# Altium project ActiTouch.PrjPcb
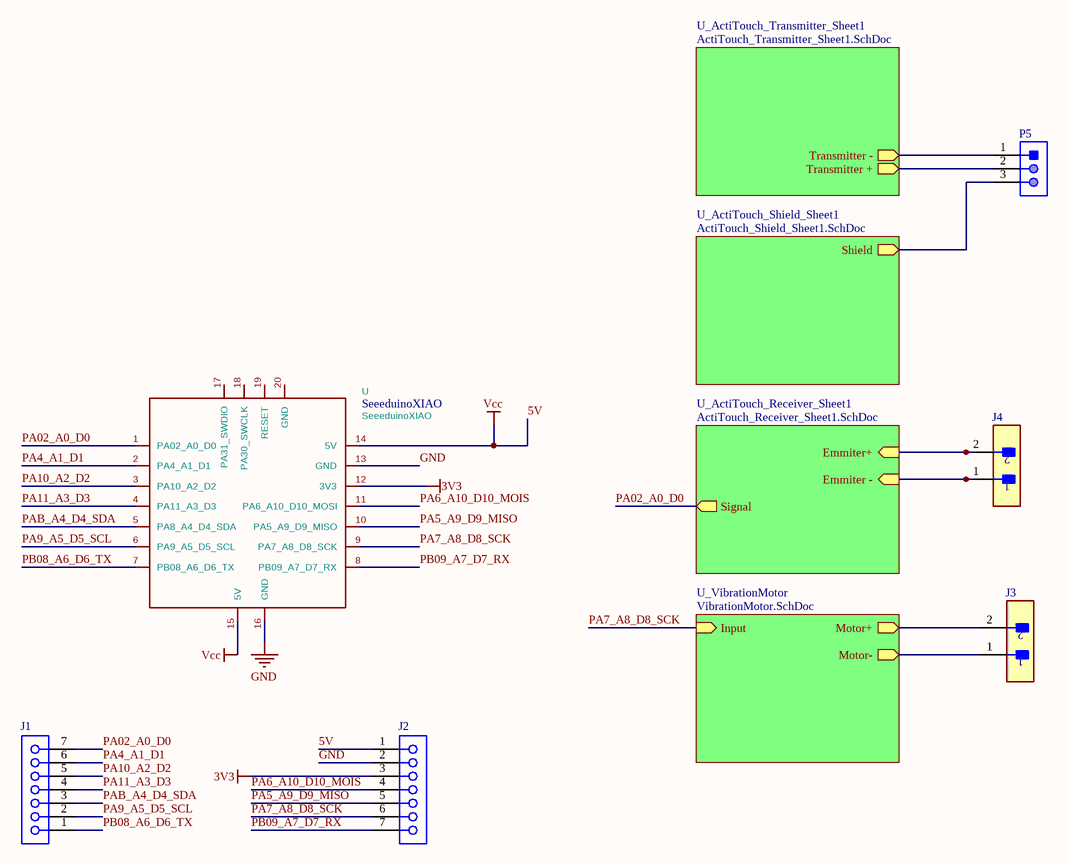
[diagram p0: ActiTouch.SchDoc]
5 sheets, 50 parts. Net scope: hierarchical (ports join the sheet entries above them; power ports are global).
Board file: PCB_Final.PcbDoc
Sheets:
  ActiTouch.SchDoc
    U_ActiTouch_Shield_Sheet1 = ActiTouch_Shield_Sheet1.SchDoc
    U_VibrationMotor = VibrationMotor.SchDoc
    U_ActiTouch_Receiver_Sheet1 = ActiTouch_Receiver_Sheet1.SchDoc
    U_ActiTouch_Transmitter_Sheet1 = ActiTouch_Transmitter_Sheet1.SchDoc

## Sheet ActiTouch.SchDoc
size A4; SheetNumber: 1; SheetTotal: 5

### Parts
J1  SSQ-107-01-G-S  [SMTC-SSQ-107-01-X-S]  (value not drawn)
J2  SSQ-107-01-G-S  [SMTC-SSQ-107-01-X-S]  (value not drawn)
J3  GRPB021VWVN-RC  [FP-GRPB021VWVN-RC-MFG]  (value not drawn)
J4  GRPB021VWVN-RC  [FP-GRPB021VWVN-RC-MFG]  (value not drawn)
P5  GRPB031VWVN-RC  [SLIN-GRPB031VWVN-RC_V]  (value not drawn)
U  SeeeduinoXIAO  [Seeeduino XIAO-MOUDLE14P-2.54-21X17.8MM]

### Sub-sheets
U_ActiTouch_Receiver_Sheet1 = ActiTouch_Receiver_Sheet1.SchDoc: Emmiter+ (in), Emmiter - (in), Signal (out)
U_ActiTouch_Shield_Sheet1 = ActiTouch_Shield_Sheet1.SchDoc: Shield (out)
U_ActiTouch_Transmitter_Sheet1 = ActiTouch_Transmitter_Sheet1.SchDoc: Transmitter + (out), Transmitter - (out)
U_VibrationMotor = VibrationMotor.SchDoc: Input (in), Motor+ (out), Motor- (out)

### Nets
3V3: J2.3 U.12(3V3)
5V: J2.1 U.14(5V) U.15(5V)  [also labelled Vcc]
GND: J2.2 U.13(GND) U.16(GND)
PA02_A0_D0: J1.7 U.1(PA02_A0_D0) ; sheet U_ActiTouch_Receiver_Sheet1/Signal
PA4_A1_D1: J1.6 U.2(PA4_A1_D1)
PA5_A9_D9_MISO: J2.5 U.10(PA5_A9_D9_MISO)
PA6_A10_D10_MOIS: J2.4 U.11(PA6_A10_D10_MOSI)
PA7_A8_D8_SCK: J2.6 U.9(PA7_A8_D8_SCK) ; sheet U_VibrationMotor/Input
PA9_A5_D5_SCL: J1.2 U.6(PA9_A5_D5_SCL)
PA10_A2_D2: J1.5 U.3(PA10_A2_D2)
PA11_A3_D3: J1.4 U.4(PA11_A3_D3)
PAB_A4_D4_SDA: J1.3 U.5(PA8_A4_D4_SDA)
PB08_A6_D6_TX: J1.1 U.7(PB08_A6_D6_TX)
PB09_A7_D7_RX: J2.7 U.8(PB09_A7_D7_RX)
NetC1_1: J3.2 ; sheet U_VibrationMotor/Motor+
NetC1_2: J3.1 ; sheet U_VibrationMotor/Motor-
NetC4_2: P5.3 ; sheet U_ActiTouch_Shield_Sheet1/Shield
NetC7_1: P5.1 ; sheet U_ActiTouch_Transmitter_Sheet1/Transmitter -
NetC8_1: P5.2 ; sheet U_ActiTouch_Transmitter_Sheet1/Transmitter +
NetC20_1: J4.2 ; sheet U_ActiTouch_Receiver_Sheet1/Emmiter+
NetC21_1: J4.1 ; sheet U_ActiTouch_Receiver_Sheet1/Emmiter -

Not connected (* = marked no-connect by the designer): U 17(PA31_SWDIO) 18(PA30_SWCLK) 19(RESET) 20(GND)

### Library data of the parts
J1 J2 = CMP-1023-00284-1: SQ Post Socket, Through-hole, Vertical, -55 to 125 degC, 2.54 mm Pitch, 7-Pin, Female, RoHS; Manufacturer: Samtec; Pitch: 2.54 mm; PackageDescription: Assembly, Socket Strip .025[0.64] SQ Tail; PartNumber: SSQ-107-01-G-S; PackageReference: SSQ-107-01-X-S; ComponentLink2URL: http://www.samtec.com/documents/webfiles/pdf/SSQ_TH.PDF; ComponentLink1URL: http://www.samtec.com; ComponentLink3Description: Package Specification; PackageVersion: BD, 6/1987; RoHS: True; DatasheetVersion: F-214; Mounting Technology: Through-hole; ComponentLink3URL: http://www.samtec.com/documents/webfiles/cpdf/SSQ-1XX-XX-XXX-X-XX-XXX-XX-X-MKT.pdf; ComponentLink1Description: Manufacturer URL; Temperature Range: -55 to 125 degC; Orientation: Vertical; ComponentLink2Description: Datasheet
J3 J4 = CMP-2000-06371-2: CONN HEADER VERT 2POS 1.27MM; Number of Positions: 2; Connector Type: Male Pin; Pitch: 0.05inch; Contact Plating: Gold; Lead Free: Lead Free; Termination: Solder; Packaging: Bulk; RoHS Compliant: Yes; Contact Type: Male Pin; Mount: Through Hole; Number of Rows: 1; Contact Mating Length: 0.118inch; Package Quantity: 1
P5 = CMP-2000-06372-1: Male Header, Pitch 1.27 mm, 1 x 3 Position, Height 4 mm, Tail Length 2.3 mm, -40 to 105 degC, RoHS, Bulk; Manufacturer: Sullins; Other Names: S9014E-03; Number of Positions: 3; Connector Type: Header,Unshrouded; Pitch: 0.050"(1.27mm); Dynamic Catalog: GRPB; Catalog Drawings: S9014ESeriesTop; Mating Products: S9010E-03-ND / -CONNHEADER.050"3POSR/APCB / S9008E-03-ND / -CONNHEADER.050"3POSPCBGOLD / S9005E-03-ND / -CONNHEADER.050"3POSSMDGOLD; Number of Positions Loaded: All; Contact Finish: Gold; Mounting Type: ThroughHole; Termination: Solder; Packaging: Bulk; Category: Connectors,Interconnects; Package Description: Male Header, Pitch 1.27 mm, 1 x 3 Position, Height 4 mm, Tail Length 2.3 mm; Standard Package: 1; Datasheet URL: http://www.sullinscorp.com/drawings/71_GRPB___1VWVN-RC,_10957-C.pdf; Package Reference: GRPB031VWVN-RC; Family: RectangularConnectors-Headers,MalePins; Number of Rows: 1; Contact Type: MalePin; Manufacturer URL: http://www.sullinscorp.com/; Mounting Technology: ThroughHole; Contact Mating Length: 0.118"(3.00mm); Contact Finish Thickness: Flash; Datasheet Version: Rev. C, 12/2008
U = SeeeduinoXIAO: Value: SeeeduinoXIAO

## Sheet ActiTouch_Shield_Sheet1.SchDoc
size A4; SheetNumber: 3; SheetTotal: 5
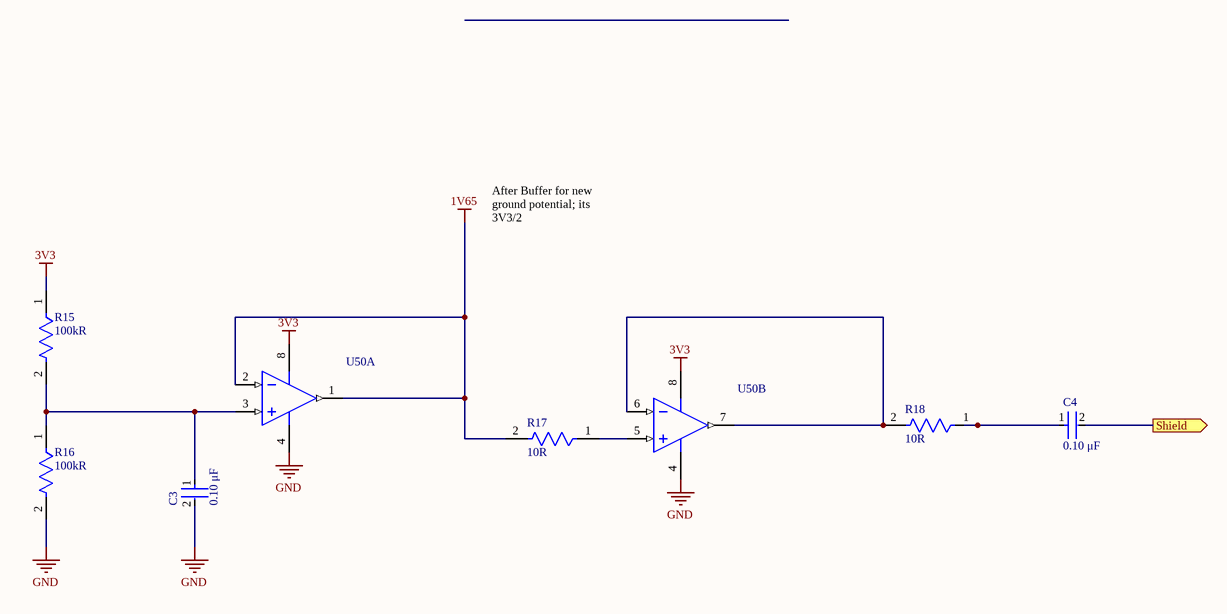
[diagram p1: ActiTouch_Shield_Sheet1.SchDoc]

### Parts
C3  value 0.10 μF  [FP-C0603C-CF-MFG]  (hidden comment: C0603C104K5RACTU)
C4  value 0.10 μF  [FP-C0603C-CF-MFG]  (hidden comment: C0603C104K5RACTU)
R15  Resistance: 100kR  [FP-ESR03-MFG]  (hidden comment: ESR03EZPJ101)
R16  Resistance: 100kR  [FP-ESR03-MFG]  (hidden comment: ESR03EZPJ101)
R17  Resistance: 10R  [FP-ESR03-MFG]  (hidden comment: ESR03EZPJ101)
R18  Resistance: 10R  [FP-ESR03-MFG]  (hidden comment: ESR03EZPJ101)
U50  LTC6253IMS8#TRPBF  [LT-MS8-8_M]  (value not drawn)  (parts A,B of 2)

### Ports
Shield (out)

### Nets
1V65: R17.2 U50.1(OUT_A) U50.2(-IN_A)
3V3: R15.1 U50.8(V+)
GND: C3.2 R16.2 U50.4(V-)
NetC3_1: C3.1 R15.2 R16.1 U50.3(+IN_A)
NetC4_1: C4.1 R18.1
NetC4_2: C4.2 ; port Shield
NetR17_1: R17.1 U50.5(+IN_B)
NetR18_2: R18.2 U50.6(-IN_B) U50.7(OUT_B)

### Notes on the sheet
- After Buffer for new ground potential; its 3V3/2

### Library data of the parts
C3 C4 = CMP-2006-03061-2: CAP CER 0.1UF 50V X7R 0603; Manufacturer: KEMET; Tolerance: 0.1; Temperature Coefficient: 30ppm/°C; Material: Ceramic; Automotive Grade: Grade 1; Temperature: -55°C to +125°C; RoHS: TRUE; Temperature Range High: +125°C; Lead Free: Yes; Octopart: https://octopart.com/c0603c104k5ractu-kemet-139244; Digikey Description: CAP CER 0.1UF 50V X7R 0603; Category: Cap; Package: C0603C-CF; ComponentLink2Description: Datasheet; Temperature Range Low: -55°C; Device Class L1: Passive Components; Voltage Rating: 50 V; Automotive: Yes; Device Class L3: Ceramic Capacitors; ComponentLink2URL: https://api.kemet.com/component-edge/download/datasheet/C0603C100J5GACAUTO.pdf; Capacitance: 0.10 μF; Device Class L2: Capacitors; Manufacturer Part Number: C0603C104K5RACTU; Temperature Characteristic: X7R; Height: 0.87mm
R15-R18 = CMP-08839-000028-1: 100Ω ±5% 0.25W 0603 Anti-Surge Chip Resistor AEC-Q200; Power Rating: 200mW; Temperature Coefficient: 200ppm/°C; Max Power Dissipation: 250mW; Case Code (Imperial): 0603; Number of Terminations: 2; RoHS Compliant: Yes; Series: ESR; Lead Free: Lead Free; Features: Automotive AEC-Q200; Case/Package: 0603; Tolerance: 5%; Min Operating Temperature: -55°C; Size Code: 0603; Case Code (Metric): 1608; Max Operating Temperature: 155°C; Packaging: Tape and Reel
U50 = CMP-0359-00902-2: Dual Channel, Power Efficient Operational Amplifier, RRIO, 720 MHz Typical GBW, 280 V/us Typical SR, 2.5 to 5.25 V, 8-Pin SOP (MS8-8), Industrial, Pb-Free, Reel; Manufacturer: Linear Technology; GBW (MHz) Typical: 720; SR (V/us) Typical: 280; Vos (mV) Typical: 0.05; Vs Max (V): 5.25; Is (mA) Typical: 3.3; Channels (#): 2; Vs Min (V): 2.5; PackageVersion: Rev G; Packing: Reel; ComponentLink1Description: Manufacturer URL; ComponentLink3URL: http://cds.linear.com/docs/en/packaging/05081610_G_SO8.pdf; PackageDescription: 8-Lead Plastic Small Outline, Body 3.9 x 4.9 mm, Pitch 1.27 mm; Linear Technology Part Number: LTC6253; DatasheetVersion: Rev. C; ComponentLink3Description: Package Specification; ComponentLink1URL: http://www.linear.com/; Mounting Technology: Surface Mount; RoHS: Pb-Free; PartNumber: LTC6253IMS8#TRPBF; ComponentLink2URL: http://cds.linear.com/docs/en/datasheet/625234fc.pdf; PackageReference: LT-MS8-8; ComponentLink2Description: Datasheet; Type: VFB; RevisionNote: URLs updated

## Sheet VibrationMotor.SchDoc
size A4; SheetNumber: 5; SheetTotal: 5
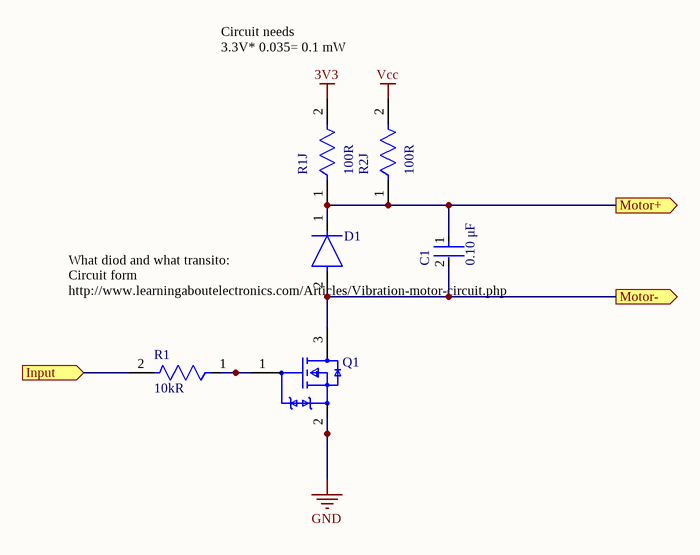
[diagram p2: VibrationMotor.SchDoc]

### Parts
C1  value 0.10 μF  [FP-C0603C-CF-MFG]  (hidden comment: C0603C104K5RACTU)
D1  LS4448GS08  [FP-6_560-5006_01-4-MFG]  (value not drawn)
Q1  DMG2302UK-7  [FP-SOT23-MFG]  (value not drawn)
R1  Resistance: 10kR  [FP-ESR03-MFG]  (hidden comment: ESR03EZPJ101)
R1J  Resistance: 100R  [FP-ESR03-MFG]  (hidden comment: ESR03EZPJ101)
R2J  Resistance: 100R  [FP-ESR03-MFG]  (hidden comment: ESR03EZPJ101)

### Ports
Input (in), Motor+ (out), Motor- (out)

### Nets
3V3: R1J.2
GND: Q1.2(S)
Vcc: R2J.2  [project net 5V]
PA7_A8_D8_SCK: R1.2 ; port Input
NetC1_1: C1.1 D1.1(C) R1J.1 R2J.1 ; port Motor+
NetC1_2: C1.2 D1.2(A) Q1.3(D) ; port Motor-
NetQ1_1: Q1.1(G) R1.1

### Notes on the sheet
- Circuit needs
  3.3V* 0.035= 0.1 mW
  With Vibro Motor
  https://www.distrelec.ch/de/vibrationsmotor-seeed-studio-316040004/p/30214484
- What diod and what transito:
  Circuit form http://www.learningaboutelectronics.com/Articles/Vibration-motor-circuit.php

### Library data of the parts
C1 = CMP-2006-03061-2: CAP CER 0.1UF 50V X7R 0603; Manufacturer: KEMET; Tolerance: 0.1; Description: C0603 0.10 μF X7R 30ppm/°C 10.00% 50 V; Temperature Coefficient: 30ppm/°C; Material: Ceramic; Automotive Grade: Grade 1; Temperature: -55°C to +125°C; RoHS: TRUE; Temperature Range High: +125°C; Lead Free: Yes; Octopart: https://octopart.com/c0603c104k5ractu-kemet-139244; Digikey Description: CAP CER 0.1UF 50V X7R 0603; Category: Cap; Package: C0603C-CF; ComponentLink2Description: Datasheet; Temperature Range Low: -55°C; Device Class L1: Passive Components; Voltage Rating: 50 V; Automotive: Yes; Device Class L3: Ceramic Capacitors; ComponentLink2URL: https://api.kemet.com/component-edge/download/datasheet/C0603C100J5GACAUTO.pdf; Capacitance: 0.10 μF; Device Class L2: Capacitors; Manufacturer Part Number: C0603C104K5RACTU; Temperature Characteristic: X7R; Height: 0.87mm
D1 = CMP-02540-000047-1: DIODE GEN PURP 100V 300MA SOD80; Manufacturer: Vishay; Max Junction Temp: +175°C; Reverse Voltage: 75V; Peak Reverse Current: 5uA; Automotive Grade: Grade 0; Value: 4pF; Max Surge Forward Current: 2A; Category: Diode; Forward Current: 300mA; ComponentLink2Description: Datasheet; Lead Free: Yes; Automotive: Yes; Device Class L1: Discrete Semiconductors; Temperature: to +175°C; Package: 6.560-5006.01-4; Max Repetitive Reverse Voltage: 100V; RoHS: TRUE; Manufacturer Part Number: LS4448GS08; ComponentLink2URL: http://www.vishay.com/docs/85561/ls4148.pdf; Device Class L3: Rectifier Diodes; Capacitance: 4pF; Octopart: https://octopart.com/ls4448gs08-vishay-55433966; Digikey Description: DIODE GEN PURP 100V 300MA SOD80; Device Class L2: Diodes; Height: 1.6mm; Mouser Description: Diodes - General Purpose, Power, Switching 100V Io/150mA 2.0 Amp IFSM; Temperature Range High: +175°C
Q1 = CMP-12801-000001-1: MOSFET N-CH 20V 2.8A SOT23; Manufacturer: Diodes Inc.; Reverse Recovery Time: 5.3ns; Gate Charge At Vgs: 2.8nC @ 10V; Turn On Delay Time: 0.6ns; Pulse Drain Current: 12A; Max Forward Diode Voltage: 1.2V; Reverse Recovery Charge: 0.5nC; Automotive Grade: Grade 0; Threshold Vgs Min: 0.3V; Number Of N Channels: 1; Standoff Height: 0.013mm; Typ Forward Diode Voltage: 0.7V; Drain To Source Resistance: 61mΩ; Rthja Max: 192°C/W; Max Junction Temp: +150°C; Input Capacitace At Vds: 130pF @ 10V; Threshold Vgs Max: 1V; Turn Off Delay Time: 4.2ns; Depletion Mode: False; Gate To Source Voltage: 12V; Power Dissipation: 0.66W; Device Class L1: Discrete Semiconductors; Footprint Url: https://www.diodes.com/assets/Package-Files/SOT23.pdf; Lead Free: Yes; Manufacturer Part Number: DMG2302UK-7; Temperature Range High: +150°C; Drain To Source Voltage: 20V; Category: Trans; Digikey Description: MOSFET N-CH 20V 2.8A SOT23; RoHS: TRUE; Device Class L2: Transistors; Height: 1.1mm; Automotive: Yes; Package: SOT23; Drain To Source Breakdown Voltage: 20V; Continuous Drain Current: 2.8A; ComponentLink2Description: Datasheet; Device Class L3: MOSFETs; Octopart: https://octopart.com/dmg2302uk-7-diodes+inc.-73850182; Temperature Range Low: -55°C; Temperature: -55°C to +150°C; Number Of Channels: 1; ComponentLink2URL: https://www.diodes.com/assets/Datasheets/DMG2302UK.pdf
R1 R1J R2J = CMP-08839-000028-1: as R15 on sheet ActiTouch_Shield_Sheet1; Case Code (Imperial): 0603; Number of Terminations: 2; RoHS Compliant: Yes; Series: ESR; Lead Free: Lead Free; Features: Automotive AEC-Q200; Case/Package: 0603; Tolerance: 5%; Min Operating Temperature: -55°C; Size Code: 0603; Case Code (Metric): 1608; Max Operating Temperature: 155°C; Packaging: Tape and Reel

## Sheet ActiTouch_Receiver_Sheet1.SchDoc
size A4; SheetNumber: 4; SheetTotal: 5
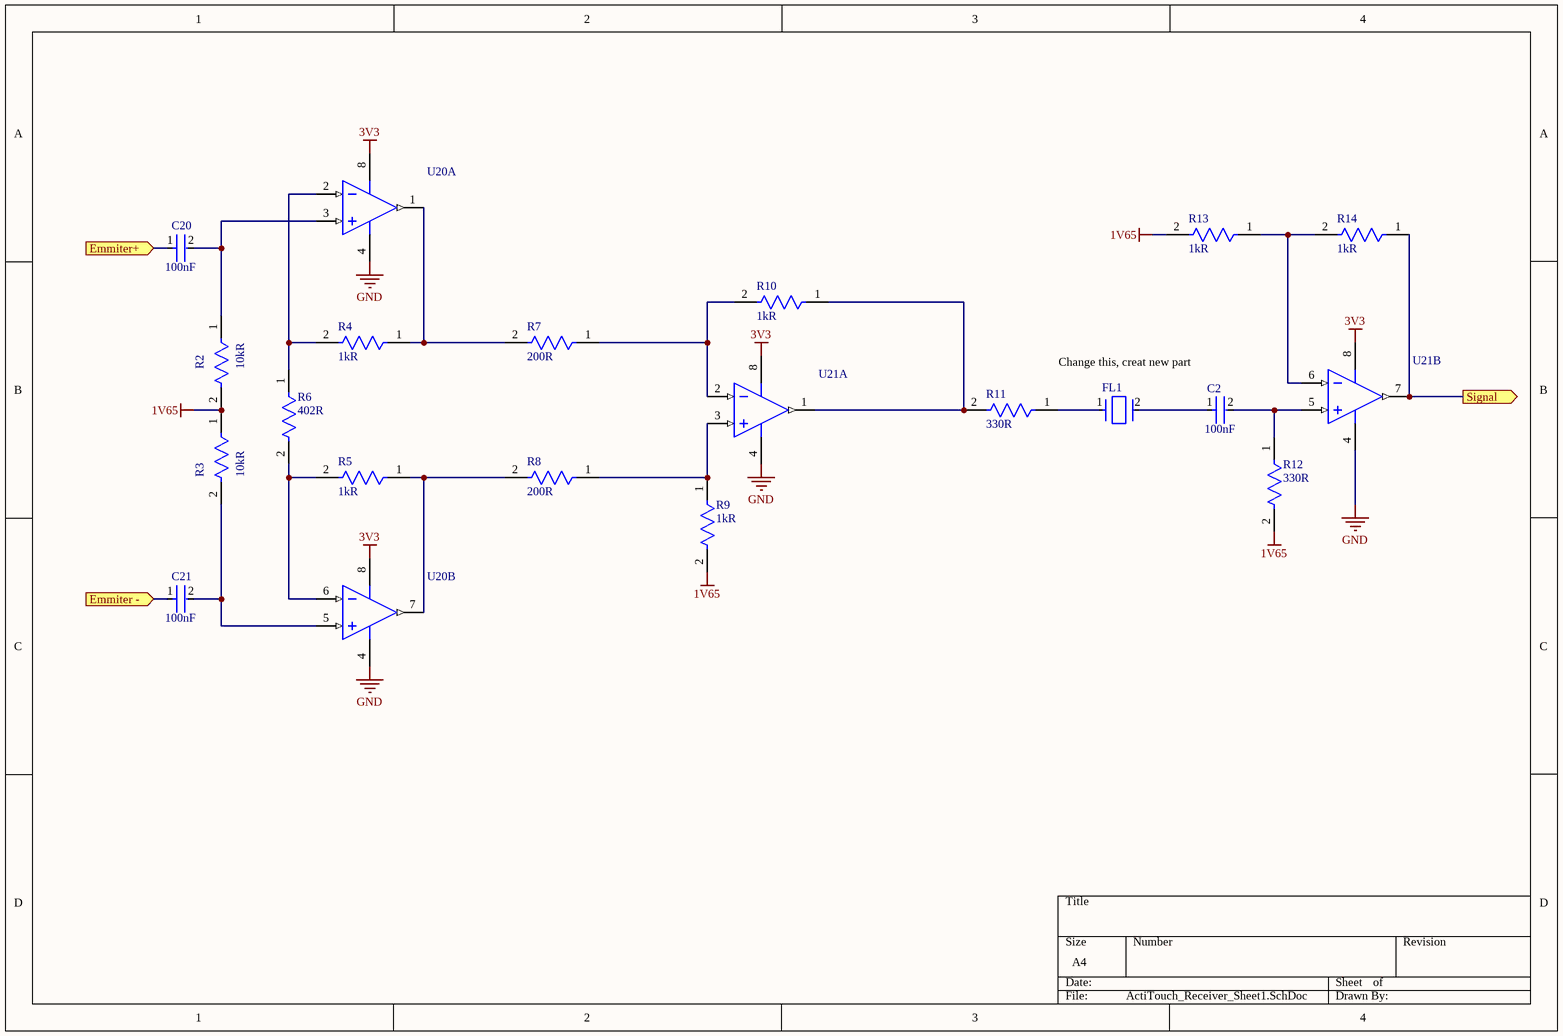
[diagram p3: ActiTouch_Receiver_Sheet1.SchDoc]

### Parts
C2  Capacitance: 100nF  [FP-0603-L_1_6_0_1-W_0_8_0-IPC_B]  (hidden comment: EMK107B7104KAHT)
C20  Capacitance: 100nF  [FP-0603-L_1_6_0_1-W_0_8_0-IPC_B]  (hidden comment: EMK107B7104KAHT)
C21  Capacitance: 100nF  [FP-0603-L_1_6_0_1-W_0_8_0-IPC_B]  (hidden comment: EMK107B7104KAHT)
FL1  CDSCB10M7GA121-R0  [FP-CDSCB10M7GA121-R0-MFG]  (value not drawn)
R2  Resistance: 10kR  [FP-ESR03-MFG]  (hidden comment: ESR03EZPJ101)
R3  Resistance: 10kR  [FP-ESR03-MFG]  (hidden comment: ESR03EZPJ101)
R4  Resistance: 1kR  [FP-ESR03-MFG]  (hidden comment: ESR03EZPJ101)
R5  Resistance: 1kR  [FP-ESR03-MFG]  (hidden comment: ESR03EZPJ101)
R6  Resistance: 402R  [FP-ESR03-MFG]  (hidden comment: ESR03EZPJ101)
R7  Resistance: 200R  [FP-ESR03-MFG]  (hidden comment: ESR03EZPJ101)
R8  Resistance: 200R  [FP-ESR03-MFG]  (hidden comment: ESR03EZPJ101)
R9  Resistance: 1kR  [FP-ESR03-MFG]  (hidden comment: ESR03EZPJ101)
R10  Resistance: 1kR  [FP-ESR03-MFG]  (hidden comment: ESR03EZPJ101)
R11  Resistance: 330R  [FP-ESR03-MFG]  (hidden comment: ESR03EZPJ101)
R12  Resistance: 330R  [FP-ESR03-MFG]  (hidden comment: ESR03EZPJ101)
R13  Resistance: 1kR  [FP-ESR03-MFG]  (hidden comment: ESR03EZPJ101)
R14  Resistance: 1kR  [FP-ESR03-MFG]  (hidden comment: ESR03EZPJ101)
U20  LTC6253IMS8#TRPBF  [LT-MS8-8_N]  (value not drawn)  (parts A,B of 2)
U21  LTC6253IMS8#TRPBF  [LT-MS8-8_N]  (value not drawn)  (parts A,B of 2)

### Ports
Emmiter - (in), Emmiter+ (in), Signal (out)

### Nets
1V65: R2.2 R3.1 R9.2 R12.2 R13.2
3V3: U20.8(V+) U21.8(V+)
GND: U20.4(V-) U21.4(V-)
PA02_A0_D0: R14.1 U21.7(OUT_B) ; port Signal
NetC2_1: C2.1 FL1.2
NetC2_2: C2.2 R12.1 U21.5(+IN_B)
NetC20_1: C20.1 ; port Emmiter+
NetC20_2: C20.2 R2.1 U20.3(+IN_A)
NetC21_1: C21.1 ; port Emmiter -
NetC21_2: C21.2 R3.2 U20.5(+IN_B)
NetFL1_1: FL1.1 R11.1
NetR4_1: R4.1 R7.2 U20.1(OUT_A)
NetR4_2: R4.2 R6.1 U20.2(-IN_A)
NetR5_1: R5.1 R8.2 U20.7(OUT_B)
NetR5_2: R5.2 R6.2 U20.6(-IN_B)
NetR7_1: R7.1 R10.2 U21.2(-IN_A)
NetR8_1: R8.1 R9.1 U21.3(+IN_A)
NetR10_1: R10.1 R11.2 U21.1(OUT_A)
NetR13_1: R13.1 R14.2 U21.6(-IN_B)

### Notes on the sheet
- Change this, creat new part

### Library data of the parts
C2 C20 C21 = CMP-14477-003798-2: None; Voltage Rating (DC): 16V; Tolerance: 10%; Package Quantity: 4000; Packaging: Tape and Reel; Lead Free: Lead Free; Voltage Rating: 16V; Halogen Free: Halogen Free; Case/Package: 0603
FL1 = CMP-06047-000004-1: Ceramic Filter 10.7MHz 2-Pin Surface Mount Emboss T/R
R2-R14 = CMP-08839-000028-1: as R15 on sheet ActiTouch_Shield_Sheet1; Case Code (Imperial): 0603; Number of Terminations: 2; RoHS Compliant: Yes; Series: ESR; Lead Free: Lead Free; Features: Automotive AEC-Q200; Case/Package: 0603; Tolerance: 5%; Min Operating Temperature: -55°C; Size Code: 0603; Case Code (Metric): 1608; Max Operating Temperature: 155°C; Packaging: Tape and Reel
U20 U21 = CMP-0359-00902-2: as U50 on sheet ActiTouch_Shield_Sheet1; PackageVersion: Rev G; Packing: Reel; ComponentLink1Description: Manufacturer URL; ComponentLink3URL: http://cds.linear.com/docs/en/packaging/05081610_G_SO8.pdf; PackageDescription: 8-Lead Plastic Small Outline, Body 3.9 x 4.9 mm, Pitch 1.27 mm; Linear Technology Part Number: LTC6253; DatasheetVersion: Rev. C; ComponentLink3Description: Package Specification; ComponentLink1URL: http://www.linear.com/; Mounting Technology: Surface Mount; RoHS: Pb-Free; PartNumber: LTC6253IMS8#TRPBF; ComponentLink2URL: http://cds.linear.com/docs/en/datasheet/625234fc.pdf; PackageReference: LT-MS8-8; ComponentLink2Description: Datasheet; Type: VFB; RevisionNote: URLs updated

## Sheet ActiTouch_Transmitter_Sheet1.SchDoc
size A4; SheetNumber: 2; SheetTotal: 5
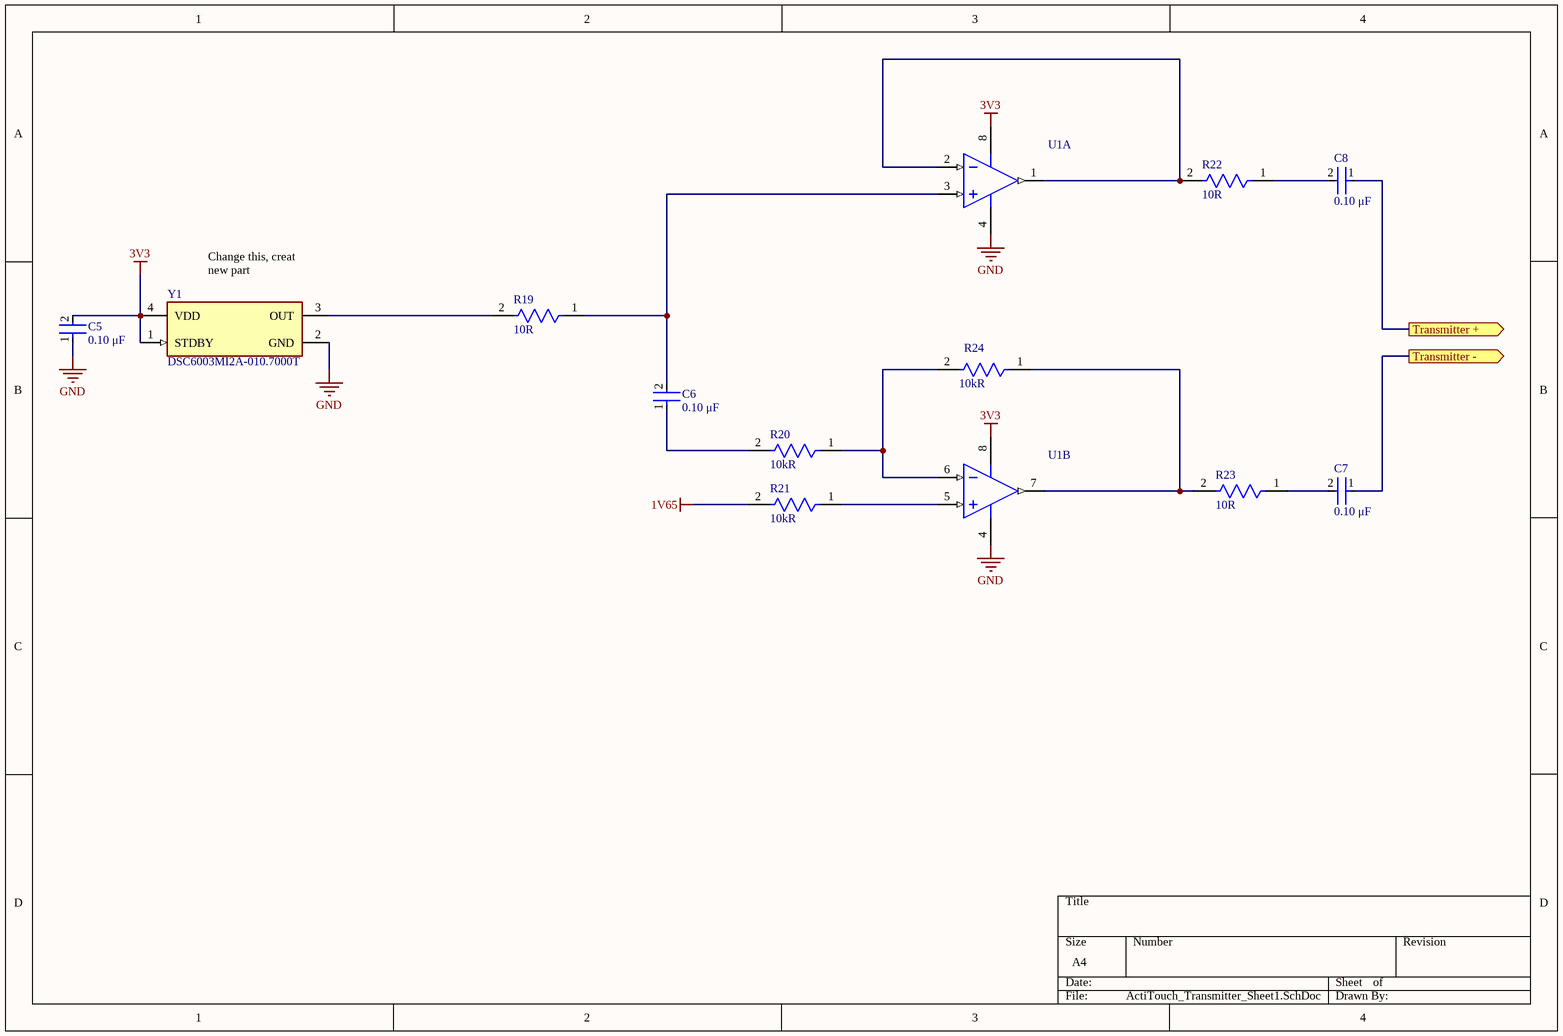
[diagram p4: ActiTouch_Transmitter_Sheet1.SchDoc]

### Parts
C5  value 0.10 μF  [FP-C0603C-CF-MFG]  (hidden comment: C0603C104K5RACTU)
C6  value 0.10 μF  [FP-C0603C-CF-MFG]  (hidden comment: C0603C104K5RACTU)
C7  value 0.10 μF  [FP-C0603C-CF-MFG]  (hidden comment: C0603C104K5RACTU)
C8  value 0.10 μF  [FP-C0603C-CF-MFG]  (hidden comment: C0603C104K5RACTU)
R19  Resistance: 10R  [FP-ESR03-MFG]  (hidden comment: ESR03EZPJ101)
R20  Resistance: 10kR  [FP-ESR03-MFG]  (hidden comment: ESR03EZPJ101)
R21  Resistance: 10kR  [FP-ESR03-MFG]  (hidden comment: ESR03EZPJ101)
R22  Resistance: 10R  [FP-ESR03-MFG]  (hidden comment: ESR03EZPJ101)
R23  Resistance: 10R  [FP-ESR03-MFG]  (hidden comment: ESR03EZPJ101)
R24  Resistance: 10kR  [FP-ESR03-MFG]  (hidden comment: ESR03EZPJ101)
U1  OPA2836IDR  [D0008A_M]  (value not drawn)  (parts A,B of 2)
Y1  DSC6003MI2A-010.7000T  [FP-C04-1202-MFG]

### Ports
Transmitter + (out), Transmitter - (out)

### Nets
1V65: R21.2
3V3: C5.2 U1.8(VS+) Y1.1(STDBY) Y1.4(VDD)
GND: C5.1 U1.4(VS-) Y1.2(GND)
NetC6_1: C6.1 R20.2
NetC6_2: C6.2 R19.1 U1.3(VIN1+)
NetC7_1: C7.1 ; port Transmitter -
NetC7_2: C7.2 R23.1
NetC8_1: C8.1 ; port Transmitter +
NetC8_2: C8.2 R22.1
NetR19_2: R19.2 Y1.3(OUT)
NetR20_1: R20.1 R24.2 U1.6(VIN2-)
NetR21_1: R21.1 U1.5(VIN2+)
NetR22_2: R22.2 U1.1(VOUT1) U1.2(VIN1-)
NetR23_2: R23.2 R24.1 U1.7(VOUT2)

### Notes on the sheet
- (near Y1) Change this, creat new part

### Library data of the parts
C5-C8 = CMP-2006-03061-2: as C3 on sheet ActiTouch_Shield_Sheet1; Temperature: -55°C to +125°C; RoHS: TRUE; Temperature Range High: +125°C; Lead Free: Yes; Octopart: https://octopart.com/c0603c104k5ractu-kemet-139244; Digikey Description: CAP CER 0.1UF 50V X7R 0603; Category: Cap; Package: C0603C-CF; ComponentLink2Description: Datasheet; Temperature Range Low: -55°C; Device Class L1: Passive Components; Voltage Rating: 50 V; Automotive: Yes; Device Class L3: Ceramic Capacitors; ComponentLink2URL: https://api.kemet.com/component-edge/download/datasheet/C0603C100J5GACAUTO.pdf; Capacitance: 0.10 μF; Device Class L2: Capacitors; Manufacturer Part Number: C0603C104K5RACTU; Temperature Characteristic: X7R; Height: 0.87mm
R19-R24 = CMP-08839-000028-1: as R15 on sheet ActiTouch_Shield_Sheet1; Case Code (Imperial): 0603; Number of Terminations: 2; RoHS Compliant: Yes; Series: ESR; Lead Free: Lead Free; Features: Automotive AEC-Q200; Case/Package: 0603; Tolerance: 5%; Min Operating Temperature: -55°C; Size Code: 0603; Case Code (Metric): 1608; Max Operating Temperature: 155°C; Packaging: Tape and Reel
U1 = CMP-0018-00293-2: Dual, Very Low Power, Rail to Rail Out, Negative Rail In, VFB Operational Amplifier, 2.5 to 5.5 V, -40 to 85 degC, 8-pin SOIC (D8), Green (RoHS & no Sb/Br); Manufacturer: Texas Instruments; Settling Time (0.1%)(Typ)(ns): 30; Iib(Max)(nA): 1000; Vio(Max)(mV): 0.4; Vs(Min)(V): 2.5; Vs(Max)(V): 5.5; Io(Typ)(mA): 50; Sub Family: High Output Current Amplifier (>=50mA), High Speed Amplifier (>=50MHz), Low Noise Amp (<=10nV/rtHz), Low Offset Voltage Amplifier (<=500uV), Low Supply Voltage Amplifier (<=2.7V); Vn at Flatband(Typ)(nV/rtHz): 4.6; Slew Rate(Typ)(V/us): 560; Number of Channels: 2; Iq per channel(Max)(mA): 1; BW @ Acl(MHz): 205; 3rd Harmonic(dBc): 105; 2nd Harmonic(dBc): 85; Mounting Technology: Surface Mount; ComponentLink3URL: http://www.ti.com/litv/pdf/msoi002j; ComponentLink1URL: http://www.ti.com/; DatasheetVersion: SLOS712D; Code_JEDEC: MS-012; PackageDescription: 8-Pin Plastic Small Outline, Body 4.9 x 3.9 mm, Pitch 1.27 mm; ComponentLink3Description: Package Specification; Eco-Plan: Green (RoHS & no Sb/Br); PackageReference: D0008A; PackageVersion: 4040047-3/M, 06/2011; PartNumber: OPA2836IDR; ComponentLink2Description: Datasheet; Acl, min stable gain(V/V): 1; ComponentLink1Description: Manufacturer URL; ComponentLink2URL: http://www.ti.com/general/docs/lit/getliterature.tsp?genericPartNumber=OPA2836&fileType=pdf
Y1 = CMP-06255-000006-1: Max Supply Current: 1.3mA; Frequency Stability: 50ppm; Frequency: 24MHz; Case/Package: SMD/SMT; Packaging: Tape and Reel; Min Operating Temperature: -40°C; Ratings: AEC-Q100; Mount: Surface Mount; Max Operating Temperature: 85°C

## Nets that join several sheets
1V65: ActiTouch_Shield_Sheet1 (R17.2 U50.1 U50.2), ActiTouch_Receiver_Sheet1 (5 pins), ActiTouch_Transmitter_Sheet1 (R21.2)
3V3: ActiTouch (J2.3 U.12), ActiTouch_Shield_Sheet1 (R15.1 U50.8), VibrationMotor (R1J.2), ActiTouch_Receiver_Sheet1 (U20.8 U21.8), ActiTouch_Transmitter_Sheet1 (C5.2 U1.8 Y1.1 Y1.4)
5V: ActiTouch (J2.1 U.14 U.15), VibrationMotor (R2J.2)
GND: ActiTouch (J2.2 U.13 U.16), ActiTouch_Shield_Sheet1 (C3.2 R16.2 U50.4), VibrationMotor (Q1.2), ActiTouch_Receiver_Sheet1 (U20.4 U21.4), ActiTouch_Transmitter_Sheet1 (C5.1 U1.4 Y1.2)
NetC1_1: ActiTouch (J3.2), VibrationMotor (C1.1 D1.1 R1J.1 R2J.1)
NetC1_2: ActiTouch (J3.1), VibrationMotor (C1.2 D1.2 Q1.3)
NetC4_2: ActiTouch (P5.3), ActiTouch_Shield_Sheet1 (C4.2)
NetC7_1: ActiTouch (P5.1), ActiTouch_Transmitter_Sheet1 (C7.1)
NetC8_1: ActiTouch (P5.2), ActiTouch_Transmitter_Sheet1 (C8.1)
NetC20_1: ActiTouch (J4.2), ActiTouch_Receiver_Sheet1 (C20.1)
NetC21_1: ActiTouch (J4.1), ActiTouch_Receiver_Sheet1 (C21.1)
PA02_A0_D0: ActiTouch (J1.7 U.1), ActiTouch_Receiver_Sheet1 (R14.1 U21.7)
PA7_A8_D8_SCK: ActiTouch (J2.6 U.9), VibrationMotor (R1.2)